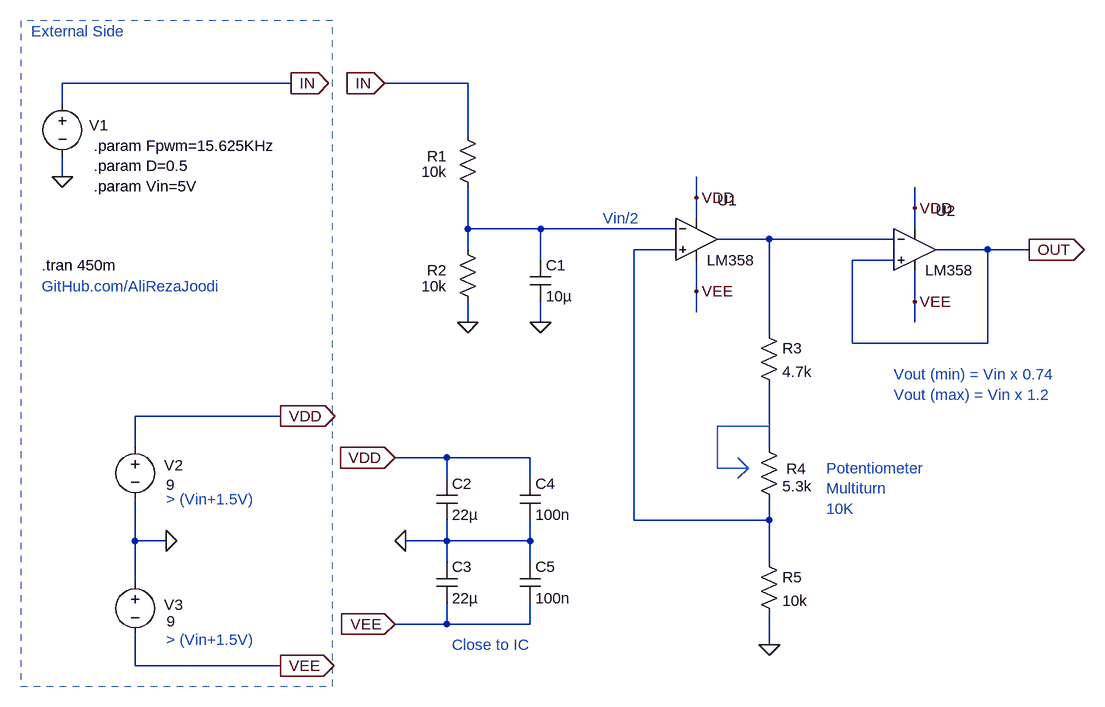
[diagram p0: schematic v1.0.asc]
v1.0.asc, the LTspice schematic file:
Version 4.1
SHEET 1 1352 1284
WIRE -672 -128 -1024 -128
WIRE -400 -128 -528 -128
WIRE -1024 -96 -1024 -128
WIRE -400 -48 -400 -128
WIRE -1024 16 -1024 -16
WIRE -48 48 -48 16
WIRE 288 64 288 32
WIRE -48 80 -48 48
WIRE -400 96 -400 32
WIRE -288 96 -400 96
WIRE -80 96 -288 96
WIRE 288 96 288 64
WIRE 64 112 -16 112
WIRE 256 112 64 112
WIRE -400 128 -400 96
WIRE -80 128 -144 128
WIRE 400 128 320 128
WIRE 464 128 400 128
WIRE -288 144 -288 96
WIRE 256 144 192 144
WIRE -48 192 -48 144
WIRE 288 208 288 160
WIRE -48 224 -48 192
WIRE -400 240 -400 208
WIRE -288 240 -288 208
WIRE 288 240 288 208
WIRE 64 256 64 112
WIRE 192 272 192 144
WIRE 400 272 400 128
WIRE 400 272 192 272
WIRE -688 384 -912 384
WIRE -912 432 -912 384
WIRE 64 432 64 336
WIRE -432 448 -512 448
WIRE -304 448 -432 448
WIRE -432 480 -432 448
WIRE -304 480 -304 448
WIRE -144 544 -144 128
WIRE 64 544 64 512
WIRE 64 544 -144 544
WIRE -912 576 -912 512
WIRE -864 576 -912 576
WIRE -432 576 -432 544
WIRE -432 576 -496 576
WIRE -304 576 -304 544
WIRE -304 576 -432 576
WIRE -432 608 -432 576
WIRE -304 608 -304 576
WIRE 64 608 64 544
WIRE -912 640 -912 576
WIRE -432 704 -432 672
WIRE -432 704 -512 704
WIRE -304 704 -304 672
WIRE -304 704 -432 704
WIRE 64 736 64 688
WIRE -912 768 -912 720
WIRE -688 768 -912 768
FLAG -1024 16 0
FLAG -288 240 0
FLAG -672 -128 IN
IOPIN -672 -128 Out
FLAG 464 128 OUT
IOPIN 464 128 Out
FLAG 288 64 VDD
FLAG -48 48 VDD
FLAG 288 208 VEE
FLAG -48 192 VEE
FLAG -688 768 VEE
IOPIN -688 768 Out
FLAG -528 -128 IN
IOPIN -528 -128 In
FLAG -864 576 0
FLAG 64 736 0
FLAG -400 240 0
FLAG -496 576 0
FLAG -688 384 VDD
IOPIN -688 384 Out
FLAG -512 448 VDD
IOPIN -512 448 In
FLAG -512 704 VEE
IOPIN -512 704 In
SYMBOL voltage -1024 -112 R0
WINDOW 0 41 49 Left 2
WINDOW 3 41 77 Invisible 2
WINDOW 123 0 0 Left 0
WINDOW 39 0 0 Left 0
SYMATTR InstName V1
SYMATTR Value PULSE(0 {Vin} 0 10n 10n {D/Fpwm} {1/Fpwm})
SYMBOL res -384 48 R180
WINDOW 0 48 64 Left 2
WINDOW 3 48 40 Left 2
SYMATTR InstName R1
SYMATTR Value 10k
SYMBOL cap -304 144 R0
SYMATTR InstName C1
SYMATTR Value 10µ
SYMBOL voltage -912 416 R0
WINDOW 0 74 44 Right 2
WINDOW 3 61 74 Right 2
WINDOW 123 0 0 Left 0
WINDOW 39 0 0 Left 0
SYMATTR InstName V2
SYMATTR Value 9
SYMBOL MyLib\\OpAmp\\LM358 288 64 R0
WINDOW 0 32 4 Left 2
WINDOW 38 35 31 Invisible 2
SYMATTR InstName U2
SYMBOL MyLib\\OpAmp\\LM358 -48 48 R0
WINDOW 0 32 4 Left 2
WINDOW 38 35 31 Invisible 2
SYMATTR InstName U1
SYMBOL voltage -912 624 R0
WINDOW 0 74 50 Right 2
WINDOW 3 62 76 Right 2
WINDOW 123 0 0 Left 0
WINDOW 39 0 0 Left 0
SYMATTR InstName V3
SYMATTR Value 9
SYMBOL res 48 240 R0
SYMATTR InstName R3
SYMATTR Value 4.7k
SYMBOL res 48 416 R0
WINDOW 0 42 49 Left 2
SYMATTR InstName R4
SYMATTR Value 5.3k
SYMBOL res 48 592 R0
SYMATTR InstName R5
SYMATTR Value 10k
SYMBOL res -384 224 R180
WINDOW 0 48 64 Left 2
WINDOW 3 48 40 Left 2
SYMATTR InstName R2
SYMATTR Value 10k
SYMBOL cap -448 480 R0
SYMATTR InstName C2
SYMATTR Value 22µ
SYMBOL cap -448 608 R0
SYMATTR InstName C3
SYMATTR Value 22µ
SYMBOL cap -320 480 R0
SYMATTR InstName C4
SYMATTR Value 100n
SYMBOL cap -320 608 R0
SYMATTR InstName C5
SYMATTR Value 100n
TEXT -976 -32 Left 2 !.param Fpwm=15.625KHz\n.param D=0.5\n.param Vin=5V
TEXT -1056 152 Left 2 !.tran 450m
TEXT -1056 184 Left 2 ;GitHub.com/AliRezaJoodi
TEXT 152 464 Left 2 ;Potentiometer\nMultiturn\n10K
TEXT -424 736 Left 2 ;Close to IC
TEXT -1072 -208 Left 2 ;External Side
TEXT -864 512 Left 2 ;> (Vin+1.5V)
TEXT -864 728 Left 2 ;> (Vin+1.5V)
TEXT -192 80 Left 2 ;Vin/2
TEXT 256 320 Left 2 ;Vout (min) = Vin x 0.74\nVout (max) = Vin x 1.2
LINE Normal -16 400 64 400
LINE Normal -16 464 -16 400
LINE Normal 32 464 -16 464
LINE Normal 16 448 32 464
LINE Normal 16 480 32 464
RECTANGLE Normal -1088 800 -608 -224 2

The netlist it stands for:
* v1.0.asc
V1 IN 0 PULSE(0 {Vin} 0 10n 10n {D/Fpwm} {1/Fpwm})
R1 N001 IN 10k
C1 N001 0 10µ
V2 VDD 0 9
* U2: LM358 (symbol MyLib\OpAmp\LM358 not available, pins judged from their places): In+=OUT In-=N002 V+=VDD V-=VEE OUT=OUT
* U1: LM358 (symbol MyLib\OpAmp\LM358 not available, pins judged from their places): In+=N003 In-=N001 V+=VDD V-=VEE OUT=N002
V3 0 VEE 9
R3 N002 N004 4.7k
R4 N004 N003 5.3k
R5 N003 0 10k
R2 0 N001 10k
C2 VDD 0 22µ
C3 0 VEE 22µ
C4 VDD 0 100n
C5 0 VEE 100n
.param Fpwm=15.625KHz
.param D=0.5
.param Vin=5V
.tran 450m
* GitHub.com/AliRezaJoodi
* Potentiometer
* Multiturn
* 10K
* Close to IC
* External Side
* > (Vin+1.5V)
* > (Vin+1.5V)
* Vin/2
* Vout (min) = Vin x 0.74
* Vout (max) = Vin x 1.2
.backanno
.end